# Altium schematic sheet Power supply.schdoc
size 293 x 182 mm
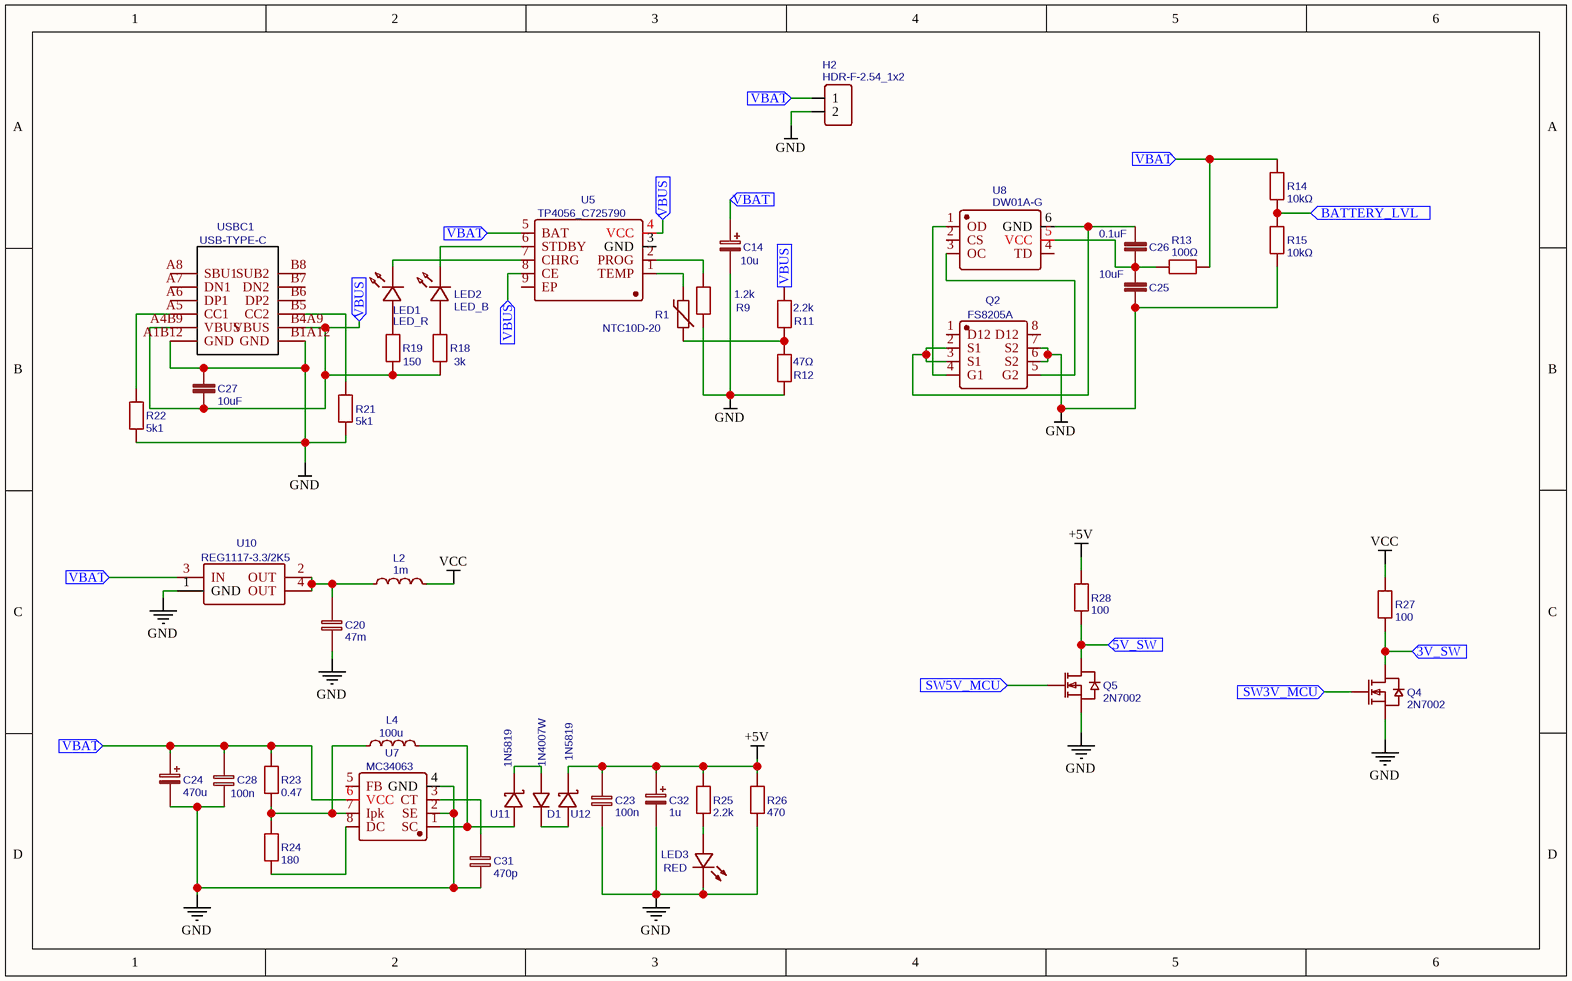
[diagram p0: Power supply.schdoc]

## Parts
C20  47m  [C0603]
C23  100n  [C0603]
C24  470u  [CASE-A_3216]
C25  10uF  [0603-CAP]
C26  0.1uF  [0603-CAP]
C27  10uF  [0603-CAP]
C28  100n  [C0603]
C31  470p  [C0603]
C32  1u  [CASE-A_3216]
D1  1N4007W  [SOD-123_L2.8-W1.8-LS3.7-RD]
H2  HDR-F-2.54_1x2  [HDR-F-2.54_1X2]
L2  1m  [L0603]
L4  100u  [L0603]
LED1  LED_R  [LED0603_RED]
LED2  LED_B  [LED0603_BLUE]
LED3  RED  [LED0805-FD]
Q2  FS8205A  [TSSOP-8_L4.4-W3.0-P0.65-LS6.4-BL-2]
Q4  2N7002  [SOT-23_L2.9-W1.3-P0.95-LS2.4-BR]
Q5  2N7002  [SOT-23_L2.9-W1.3-P0.95-LS2.4-BR]
R1  NTC10D-20  [THERMISTOR PCB]
R9  1.2k  [R0603]
R11  2.2k  [R0603]
R12  47Ω  [R0603]
R13  100Ω  [R0603]
R14  10kΩ  [R0603]
R15  10kΩ  [R0603]
R18  3k  [R0603]
R19  150  [R0603]
R21  5k1  [R0603]
R22  5k1  [R0603]
R23  0.47  [R0603]
R24  180  [R0603]
R25  2.2k  [R0603]
R26  470  [R0603]
R27  100  [R0603]
R28  100  [R0603]
U5  TP4056_C725790  [ESOP-8_L4.9-W3.9-P1.27-LS6.0-BL-EP]
U6  electrolitic_cap_th_to_smd  [TH_CAP_TO_SMD]  (value not drawn)
U7  MC34063  [SOP-8_L5.0-W4.0-P1.27-LS6.2-BL]
U8  DW01A-G  [SOT-23-6_L2.9-W1.6-P0.95-LS2.8-BR]
U10  REG1117-3.3/2K5  [SOT-223_L6.5-W3.5-P2.30-LS7.0-BR]
U11  1N5819  [DO-41_BD2.8-L5.2-P9.20-D0.8-RD]
U12  1N5819  [DO-41_BD2.8-L5.2-P9.20-D0.8-RD]
USBC1  USB-TYPE-C  [USB-TYPE-C_20PIN-FEMALE_TYPE-C-31-M-14]

## Ports
3V_SW (in), 5V_SW (in), BATTERY_LVL (in), SW3V_MCU (in), SW5V_MCU (in), VBAT (in), VBUS (in)

## Nets
+5V: C23.2 C32.1 R25.2 R26.2 R28.2 U12.1(K)
GND: C20.1 C23.1 C24.2 C25.2 C27.2 C28.1 C31.1 C32.2 H2.2 LED3.2(K) Q2.6(S2) Q2.7(S2) Q4.2(S) Q5.2(S) R9.1 R12.1 R15.2 R21.1 R22.1 R26.1 U6.2 U7.2(SE) U7.4(GND) U10.1(GND) USBC1.A1B12(GND) USBC1.B1A12(GND)
VCC: L2.2 R27.2
3V_SW: Q4.3(D) R27.1 ; port 3V_SW
5V_SW: Q5.3(D) R28.1 ; port 5V_SW
BATTERY_LVL: R14.2 R15.1 ; port BATTERY_LVL
SW3V_MCU: Q4.1(G) ; port SW3V_MCU
SW5V_MCU: Q5.1(G) ; port SW5V_MCU
VBAT: C24.1 C28.2 H2.1 R13.1 R14.1 R23.2 U5.5(BAT) U6.1 U7.6(VCC) U10.3(IN) ; port VBAT
VBUS: C27.1 R11.2 R18.1 R19.1 U5.4(VCC) U5.8(CE) USBC1.A4B9(VBUS) USBC1.B4A9(VBUS) ; port VBUS
NetC20_2: C20.2 L2.1 U10.2(OUT) U10.4(OUT)
NetC25_1: C25.1 C26.2 R13.2 U8.5(VCC)
NetC26_1: C26.1 Q2.2(S1) Q2.3(S1) U8.6(GND)
NetC31_2: C31.2 U7.3(CT)
NetD1_1: D1.1 U12.2(A)
NetD1_2: D1.2 U11.1(K)
NetL4_1: L4.1 R23.1 R24.2 U7.7(Ipk)
NetL4_2: L4.2 U7.1(SC) U11.2(A)
NetLED1_1: LED1.1 R19.2
NetLED1_2: LED1.2 U5.7(CHRG)
NetLED2_1: LED2.1 R18.2
NetLED2_2: LED2.2 U5.6(STDBY)
NetLED3_1: LED3.1(A) R25.1
NetQ2_4: Q2.4(G1) U8.1(OD)
NetQ2_5: Q2.5(G2) U8.3(OC)
NetR1_1: R1.1 U5.1(TEMP)
NetR1_2: R1.2 R11.1 R12.2
NetR9_2: R9.2 U5.2(PROG)
NetR21_2: R21.2 USBC1.B5(CC2)
NetR22_2: R22.2 USBC1.A5(CC1)
NetR24_1: R24.1 U7.8(DC)

Not connected (* = marked no-connect by the designer): Q2 1(D12) 8(D12); U5 3(GND) 9(EP); U7 5(FB); U8 2(CS) 4(TD); USBC1 A6(DP1) A7(DN1) A8(SBU1) B6(DP2) B7(DN2) B8(SUB2)

## Notes on the sheet
- (in symbol electrolitic_cap_th_to_smd) C14; 10u

## Library data of the parts
C20 = 47m: nameAlias: Value(F); Contributor: LCEDA_Lib; spicePre: C; spiceSymbolName: C_0603_EU
C23 C28 = 100n: nameAlias: Value(F); Contributor: LCEDA_Lib; spicePre: C; spiceSymbolName: C_0603_EU
C24 = 470u: nameAlias: Value(F); Contributor: LCEDA_Lib; spicePre: C; spiceSymbolName: C_Tan_SMD_A_EU
C25 C27 = 10uF: description: CAP-00810; Contributor: SparkFun; spicePre: C; spiceSymbolName: 0.1UF-25V(+80_-20%)(0603)
C26 = 0.1uF: description: CAP-00810; Contributor: SparkFun; spicePre: C; spiceSymbolName: 0.1UF-25V(+80_-20%)(0603)
C31 = 470p: nameAlias: Value(F); Contributor: LCEDA_Lib; spicePre: C; spiceSymbolName: C_0603_EU
C32 = 1u: nameAlias: Value(F); Contributor: LCEDA_Lib; spicePre: C; spiceSymbolName: C_Tan_SMD_A_EU
D1 = 1N4007W: BOM_Manufacturer: BLUE ROCKET; Contributor: LCEDA_Lib; BOM_Supplier: LCSC; BOM_Supplier Part: C328592; BOM_Manufacturer Part: 1N4007W; spicePre: D; spiceSymbolName: 1N4007W
H2 = HDR-F-2.54_1x2: Contributor: LCEDA_Lib; BOM_Supplier Part: C49661; BOM_Supplier: LCSC; spicePre: H; spiceSymbolName: HDR-F-2.54_1x2
L2 = 1m: nameAlias: Value(H); Contributor: LCEDA_Lib; spicePre: L; spiceSymbolName: L0603_US
L4 = 100u: nameAlias: Value(H); Contributor: LCEDA_Lib; spicePre: L; spiceSymbolName: L0603_US
LED1 = LED_R: BOM_Manufacturer: EVERLIGHT(台湾亿光); BOM_Manufacturer Part: 19-217/R6C-AL1M2VY/3T; Contributor: LCEDA_01; BOM_Supplier Part: C72044; BOM_Supplier: LCSC; spicePre: L; spiceSymbolName: LED-0603_R
LED2 = LED_B: BOM_Manufacturer: EVERLIGHT(台湾亿光); BOM_Manufacturer Part: 19-217/BHC-ZL1M2RY/3T; Contributor: LCEDA_01; BOM_Supplier Part: C72041; BOM_Supplier: LCSC; spicePre: L; spiceSymbolName: LED-0603_B
LED3 = RED: BOM_Manufacturer: KENTO; BOM_Manufacturer Part: whiteLEDSMD; BOM_Supplier: LCSC; BOM_Supplier Part: C34499; BOM_JLCPCB Part Class: Basic Part; spicePre: L; spiceSymbolName: whiteLEDSMD
Q2 = FS8205A: BOM_Manufacturer: FORTUNE; BOM_Supplier: LCSC; BOM_Manufacturer Part: FS8205A; BOM_Supplier Part: C16052; BOM_JLCPCB Part Class: Extended Part; spicePre: Q; spiceSymbolName: FS8205A
Q4 Q5 = 2N7002: BOM_Manufacturer: Nexperia; BOM_Manufacturer Part: 2N7002,215; BOM_Paste Type: expand; Contributor: LCEDA_Lib; BOM_Supplier: LCSC; image: //image.lceda.cn/szlcsc/C65189.jpg; BOM_Supplier Part: C65189; spicePre: Q; spiceSymbolName: 2N7002
R1 = NTC10D-20: BOM_Manufacturer: RUILON; BOM_Manufacturer Part: NTCThermistor; nameAlias: Value; Contributor: wm_irsyaduddin; BOM_Supplier Part: C42975; spicePre: R; spiceSymbolName: Thermistor
R9 = 1.2k: BOM_Manufacturer: Resistor.Today; BOM_Manufacturer Part: TCTR0603F47K0F3960T; Contributor: LCSC; BOM_Supplier: LCSC; BOM_Supplier Part: C525388; BOM_JLCPCB Part Class: Extended Part; spicePre: R; spiceSymbolName: TCTR0603F47K0F3960T
R11 = 2.2k: BOM_Manufacturer: Resistor.Today; BOM_Manufacturer Part: TCTR0603F47K0F3960T; Contributor: LCSC; BOM_Supplier: LCSC; BOM_Supplier Part: C525388; BOM_JLCPCB Part Class: Extended Part; spicePre: R; spiceSymbolName: TCTR0603F47K0F3960T
R12 = 47Ω: BOM_Manufacturer: Resistor.Today; BOM_Manufacturer Part: TCTR0603F47K0F3960T; Contributor: LCSC; BOM_Supplier: LCSC; BOM_Supplier Part: C525388; BOM_JLCPCB Part Class: Extended Part; spicePre: R; spiceSymbolName: TCTR0603F47K0F3960T
R13 = 100Ω: BOM_Manufacturer: Resistor.Today; BOM_Manufacturer Part: TCTR0603F47K0F3960T; Contributor: LCSC; BOM_Supplier: LCSC; BOM_Supplier Part: C525388; BOM_JLCPCB Part Class: Extended Part; spicePre: R; spiceSymbolName: TCTR0603F47K0F3960T
R14 R15 = 10kΩ: BOM_Manufacturer: Resistor.Today; BOM_Manufacturer Part: TCTR0603F47K0F3960T; Contributor: LCSC; BOM_Supplier: LCSC; BOM_Supplier Part: C525388; BOM_JLCPCB Part Class: Extended Part; spicePre: R; spiceSymbolName: TCTR0603F47K0F3960T
R18 = 3k: BOM_Manufacturer: Resistor.Today; BOM_Manufacturer Part: TCTR0603F47K0F3960T; Contributor: LCSC; BOM_Supplier: LCSC; BOM_Supplier Part: C525388; BOM_JLCPCB Part Class: Extended Part; spicePre: R; spiceSymbolName: TCTR0603F47K0F3960T
R19 = 150: BOM_Manufacturer: Resistor.Today; BOM_Manufacturer Part: TCTR0603F47K0F3960T; Contributor: LCSC; BOM_Supplier: LCSC; BOM_Supplier Part: C525388; BOM_JLCPCB Part Class: Extended Part; spicePre: R; spiceSymbolName: TCTR0603F47K0F3960T
R21 R22 = 5k1: nameAlias: Value(Ω); Contributor: LCEDA_Lib; spicePre: R; spiceSymbolName: R_0603_EU
R23 = 0.47: nameAlias: Value(Ω); Contributor: LCEDA_Lib; spicePre: R; spiceSymbolName: R_0603_EU
R24 = 180: nameAlias: Value(Ω); Contributor: LCEDA_Lib; spicePre: R; spiceSymbolName: R_0603_EU
R25 = 2.2k: nameAlias: Value(Ω); Contributor: LCEDA_Lib; spicePre: R; spiceSymbolName: R_0603_EU
R26 = 470: nameAlias: Value(Ω); Contributor: LCEDA_Lib; spicePre: R; spiceSymbolName: R_0603_EU
R27 R28 = 100: nameAlias: Value(Ω); Contributor: LCEDA_Lib; spicePre: R; spiceSymbolName: R_0603_EU
U5 = TP4056_C725790: BOM_Manufacturer: UMW(Youtai Semiconductor Co., Ltd.); BOM_Manufacturer Part: TP4056; Contributor: LCSC; BOM_Supplier: LCSC; BOM_Supplier Part: C725790; BOM_JLCPCB Part Class: Extended Part; spicePre: U; spiceSymbolName: TP4056_C725790
U6 = electrolitic_cap_th_to_smd: Contributor: c3xp; spicePre: U; spiceSymbolName: electrolitic_cap_th_to_smd
U7 = MC34063: BOM_Manufacturer: UMW(友台半导体); BOM_Manufacturer Part: MC34063ADR; Contributor: lcsc; BOM_Supplier: LCSC; BOM_Supplier Part: C3014308; link: https://atta.szlcsc.com/upload/public/pdf/source/20220516/88AE1B1DEFDD868D362DEBC351A9CC18.pdf; spicePre: U; spiceSymbolName: MC34063ADR_C3014308
U8 = DW01A-G: BOM_Manufacturer: FORTUNE; Contributor: LCSC; BOM_Supplier: LCSC; BOM_Manufacturer Part: DW01A-G; BOM_Supplier Part: C61503; BOM_JLCPCB Part Class: Extended Part; spicePre: U; spiceSymbolName: DW01A-G
U10 = REG1117-3.3/2K5: BOM_Manufacturer: TI; Contributor: LCSC; BOM_Supplier: LCSC; BOM_Manufacturer Part: REG1117-3.3/2K5; BOM_Supplier Part: C139396; BOM_JLCPCB Part Class: Extended Part; spicePre: U; spiceSymbolName: REG1117-3.3/2K5
U11 U12 = 1N5819: BOM_Manufacturer: YFW(佑风微); Contributor: lcsc; BOM_Supplier: LCSC; BOM_Supplier Part: C3039965; BOM_Manufacturer Part: 1N5819; link: https://atta.szlcsc.comnull; spicePre: U; spiceSymbolName: 1N5819_C3039965
USBC1 = USB-TYPE-C: BOM_Manufacturer: Rectangular Connectors - Contacts; BOM_Manufacturer Part: TYPE-C-31-M-14; Contributor: Dragomir Liviu Marian; BOM_Supplier Part: C223907; spicePre: U; spiceSymbolName: USB-TYPE-C